# EAGLE design cartridge_e7 (EAGLE 7.7.0)
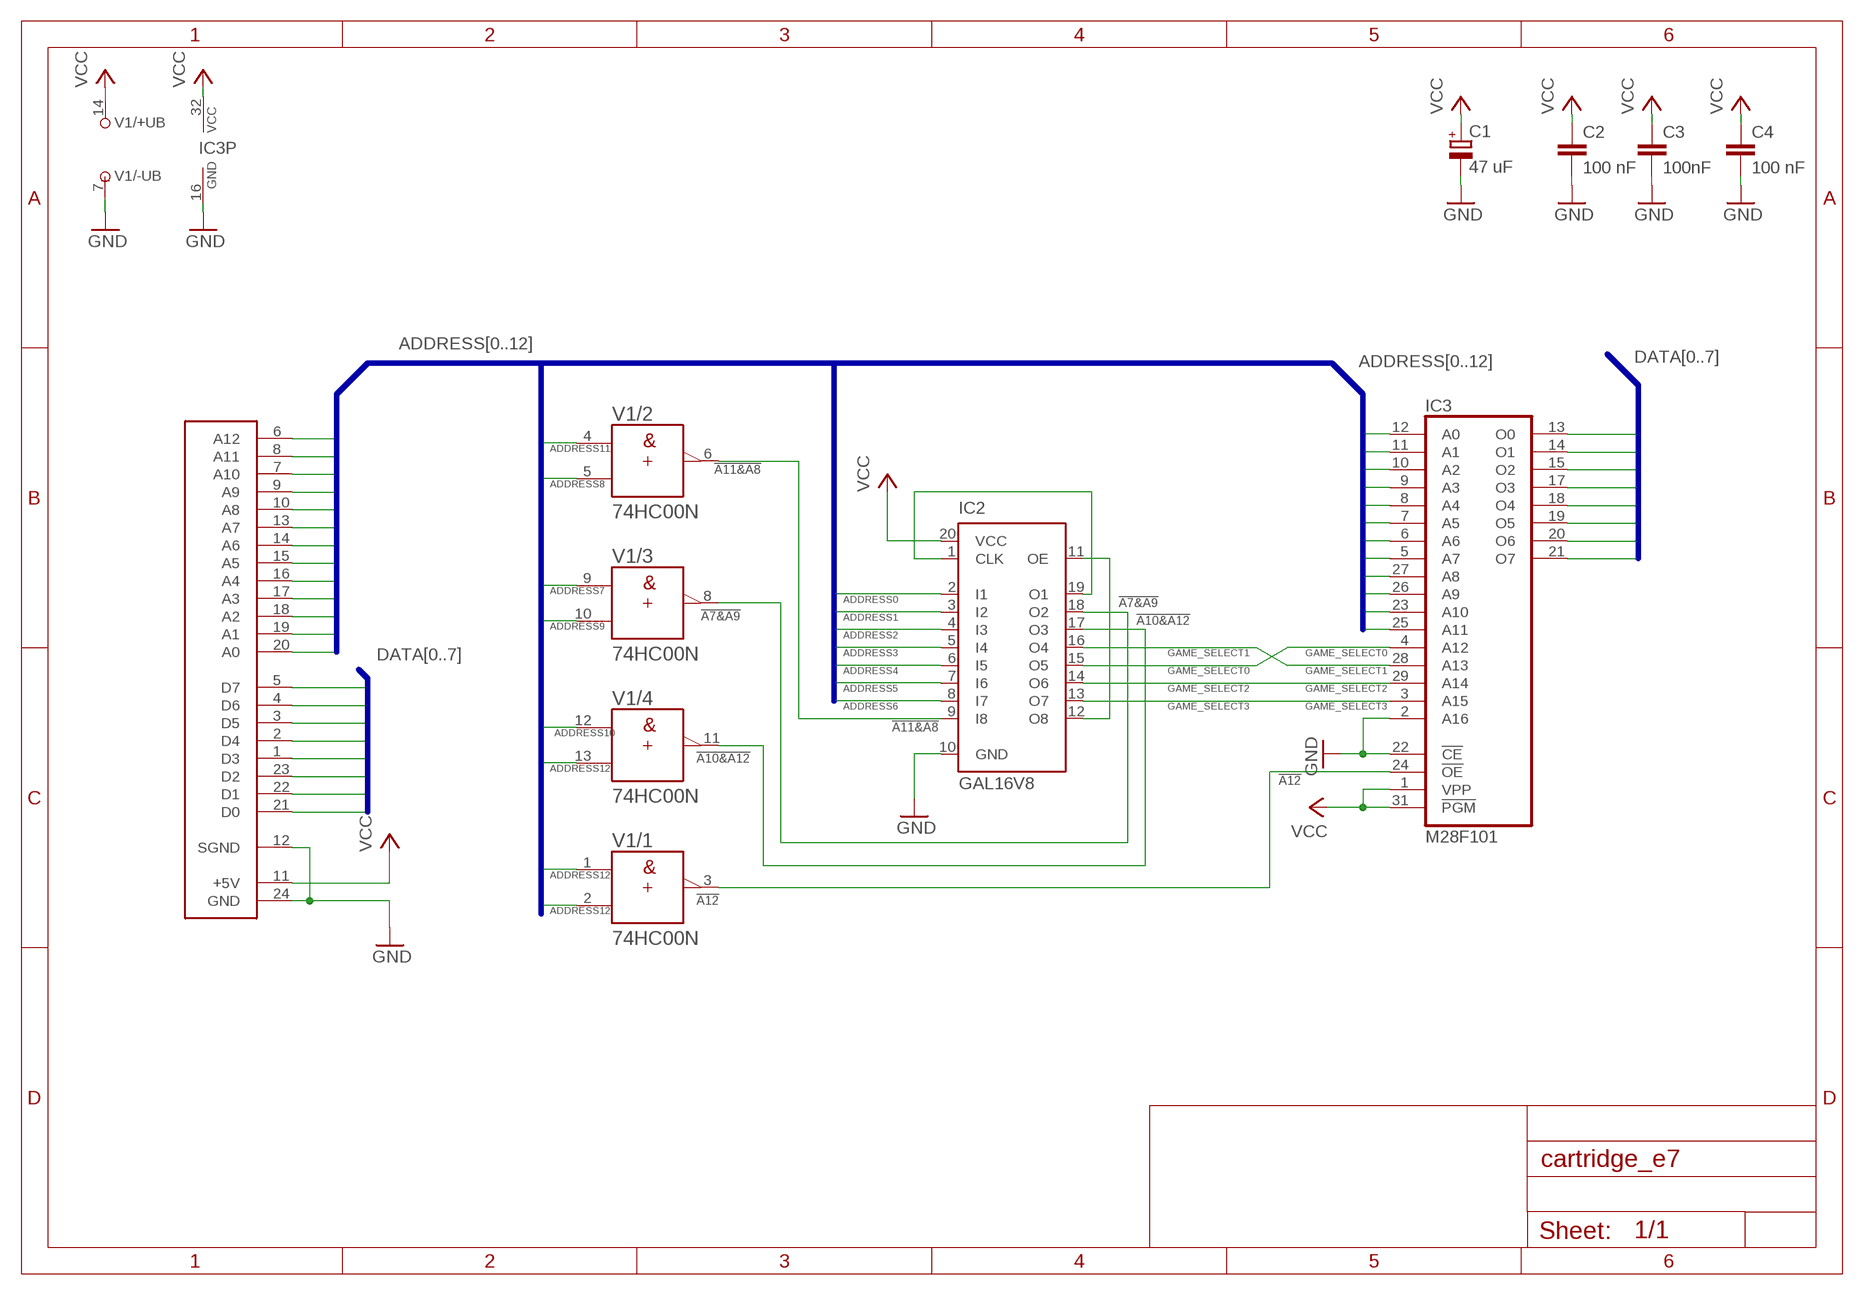
[diagram p0: schematic, sheet 1]

## Parts
C1  47 uF  CPOL-EUE3.5-8  [E3,5-8]
C2  100 nF  C-EU050-024X044  [C050-024X044]
C3  100nF  C-EU050-024X044  [C050-024X044]
C4  100 nF  C-EU050-024X044  [C050-024X044]
CONN1  24POSCELARGE  [2600LARGE]
IC2  GAL16V8  ATF16V8BP3  [DIL20]
IC3  M28F101  27010  [DIL32]
V1  74HC00N  [DIL14]

## Nets
!A7&A9: IC2.18(O2) V1.8(/3:Y)
!A10&A12: IC2.17(O3) V1.11(/4:Y)
!A11&A8: IC2.9(I8) V1.6(/2:Y)
!A12: IC3.24(!OE) V1.3(/1:Y)
ADDRESS0: CONN1.20(A0) IC2.2(I1) IC3.12(A0)
ADDRESS1: CONN1.19(A1) IC2.3(I2) IC3.11(A1)
ADDRESS2: CONN1.18(A2) IC2.4(I3) IC3.10(A2)
ADDRESS3: CONN1.17(A3) IC2.5(I4) IC3.9(A3)
ADDRESS4: CONN1.16(A4) IC2.6(I5) IC3.8(A4)
ADDRESS5: CONN1.15(A5) IC2.7(I6) IC3.7(A5)
ADDRESS6: CONN1.14(A6) IC2.8(I7) IC3.6(A6)
ADDRESS7: CONN1.13(A7) IC3.5(A7) V1.9(/3:A)
ADDRESS8: CONN1.10(A8) IC3.27(A8) V1.5(/2:B)
ADDRESS9: CONN1.9(A9) IC3.26(A9) V1.10(/3:B)
ADDRESS10: CONN1.7(A10) IC3.23(A10) V1.12(/4:A)
ADDRESS11: CONN1.8(A11) IC3.25(A11) V1.4(/2:A)
ADDRESS12: CONN1.6(A12) V1.1(/1:A) V1.2(/1:B) V1.13(/4:B)
DATA0: CONN1.21(D0) IC3.13(O0)
DATA1: CONN1.22(D1) IC3.14(O1)
DATA2: CONN1.23(D2) IC3.15(O2)
DATA3: CONN1.1(D3) IC3.17(O3)
DATA4: CONN1.2(D4) IC3.18(O4)
DATA5: CONN1.3(D5) IC3.19(O5)
DATA6: CONN1.4(D6) IC3.20(O6)
DATA7: CONN1.5(D7) IC3.21(O7)
GAME_SELECT0: IC2.15(O5) IC3.4(A12)
GAME_SELECT1: IC2.16(O4) IC3.28(A13)
GAME_SELECT2: IC2.14(O6) IC3.29(A14)
GAME_SELECT3: IC2.13(O7) IC3.3(A15)
GND: C1.- C2.2 C3.2 C4.2 CONN1.12(SGND) CONN1.24(GND) IC2.10(GND) IC3.2(A16) IC3.16(GND) IC3.22(!CE) V1.7(/-UB:-UB)
N$1: IC2.11(OE) IC2.12(O8)
N$2: IC2.1(CLK) IC2.19(O1)
VCC: C1.+ C2.1 C3.1 C4.1 CONN1.11(+5V) IC2.20(VCC) IC3.1(VPP) IC3.31(!PGM) IC3.32(VCC) V1.14(/+UB:+UB)

## Buses
DATA[0..7]
ADDRESS[0..12]

## Library data of the parts
C1 = resistor:CPOL-EU: POLARIZED CAPACITOR, European symbol
C2-C4 = resistor:C-EU: CAPACITOR, European symbol
CONN1 = 2600:24POSCE
IC2 = atmel:ATF16V8B: High perfomance CMOS (electrically erasable) programmable logic device (PLD) ABLE-Atmel-ABEL - P18V8R, P16V8C, P16V8AS, P17V8 COPL Atmel-WinCUPL - G16V8MS, G16V8MA, G16V8AS, G16V8 LOG/IC - GAL16V8_R, GAL16V8_G7, GAL16V8_C), GAL16V8 Tango-PLD - G16V8R, G16V8C, G16V8AS, G16V8 Source: http://www.atmel.com/dyn/resources/prod_documents/DOC0364.PDF; MPN: ATF16V8CZ-15PU; OC_FARNELL: 1551768; OC_NEWARK: 94M6254
IC3 = memory:27010: MEMORY; SPICEPREFIX: X
V1 = 74ttl-din:74*00: Quad 2-input NAND gate

## Board
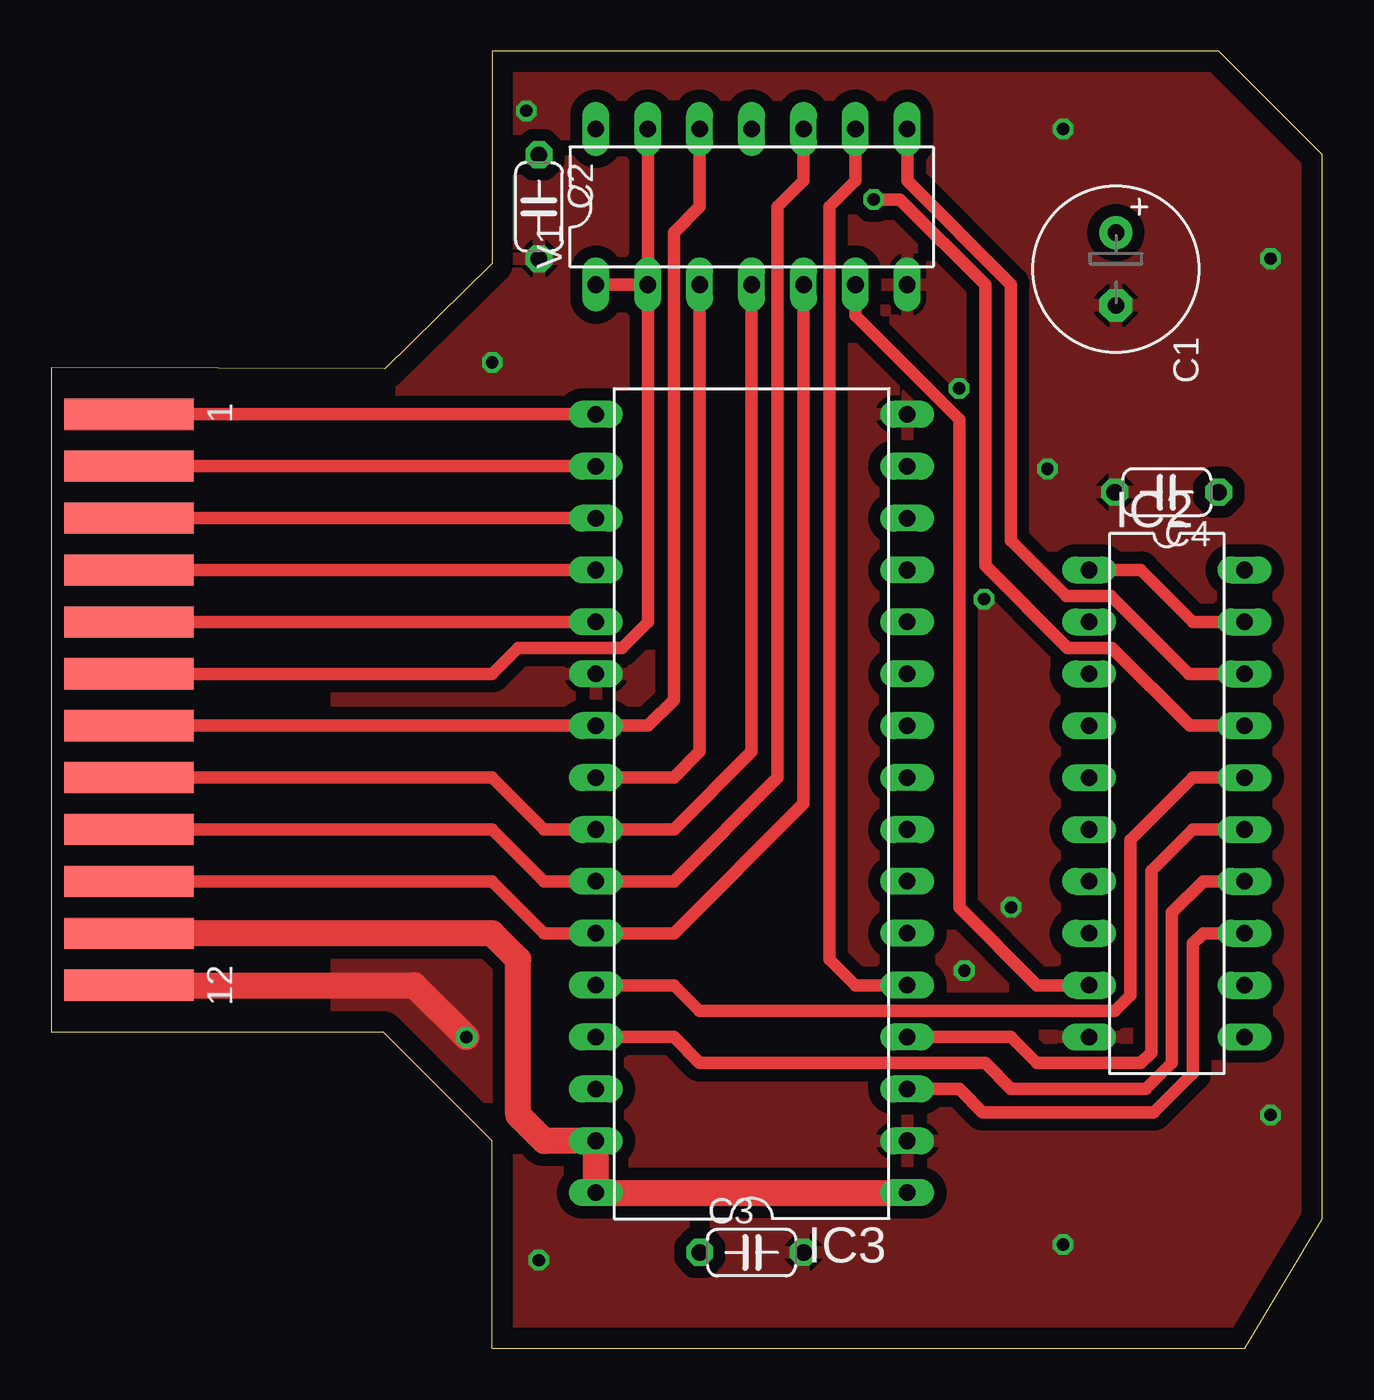
[diagram p1: board, top side]
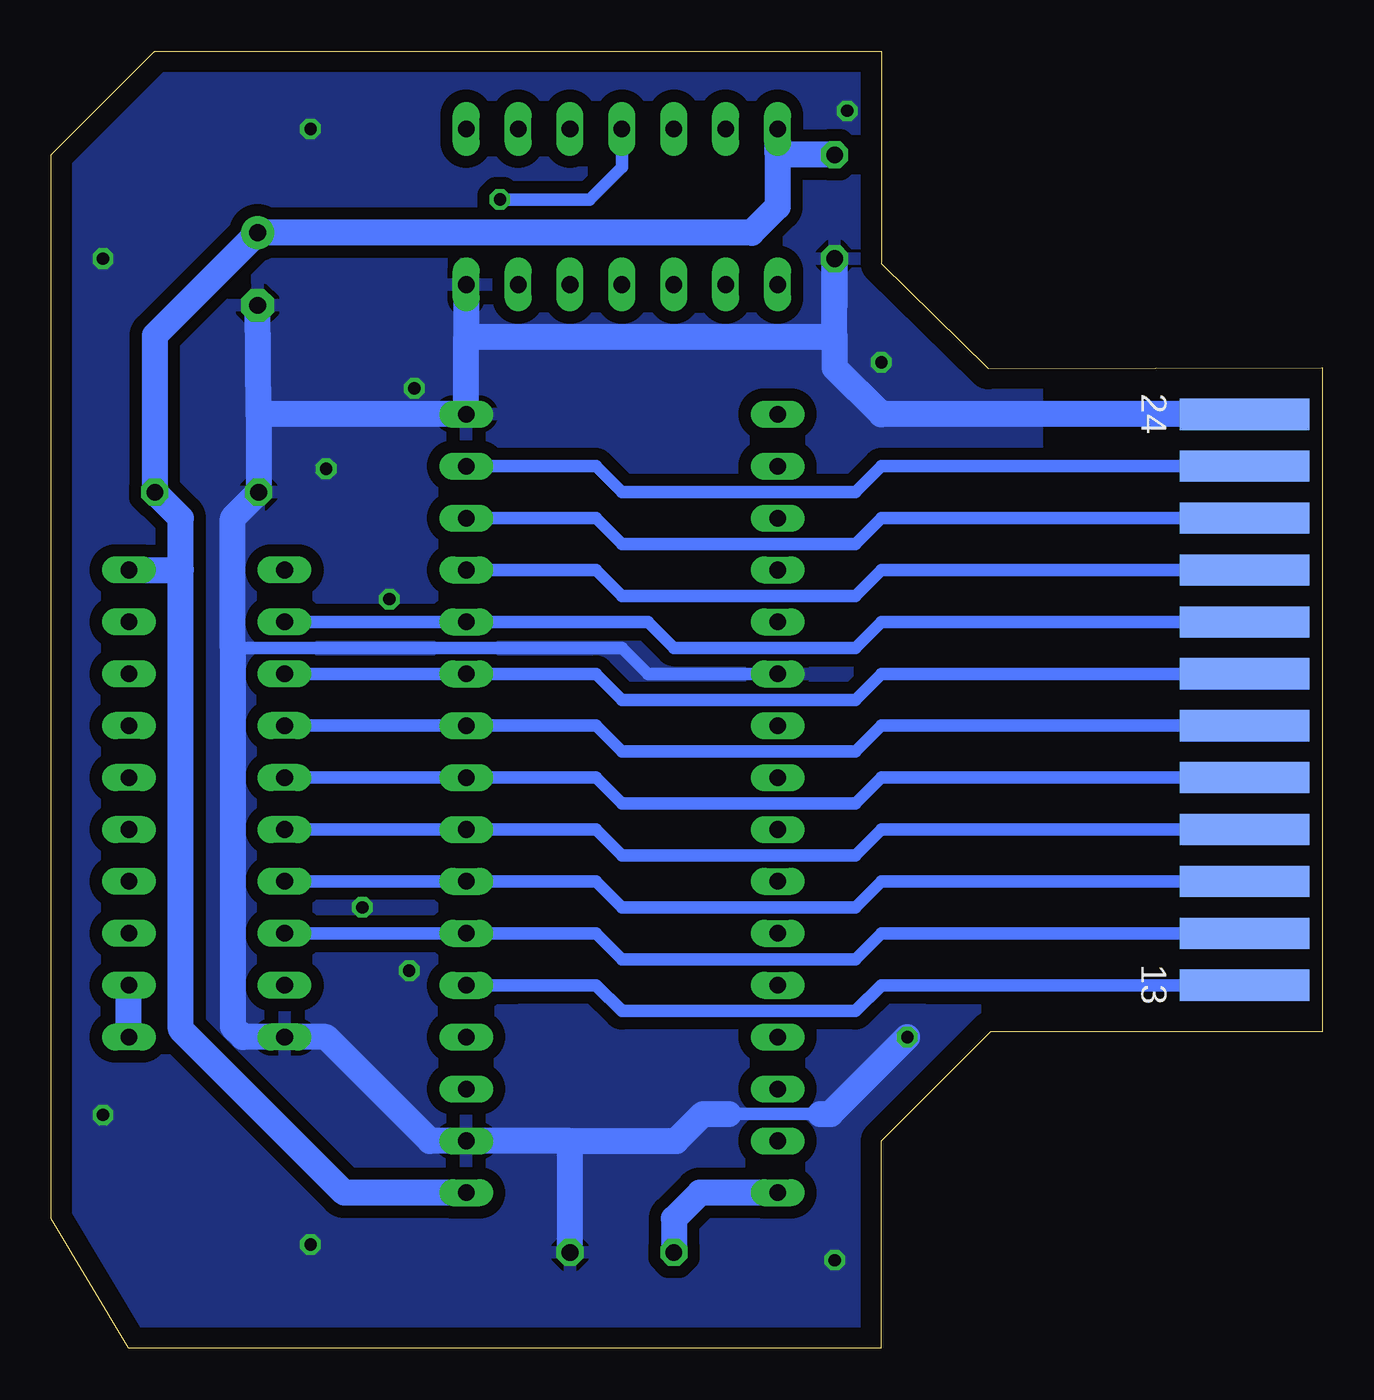
[diagram p2: board, bottom side, seen from below]

Size 62.23 x 63.5 mm. Coordinates in mm from the lower left corner, seen from the top.
Outline: 0,15.49 16.26,15.49 21.59,10.16 21.59,0 58.42,0 62.23,6.35 62.23,58.42 57.15,63.5 21.59,63.5 21.59,53.09 16.36,47.96 0,48.01 0,15.49
Copper layers (1*16): Top 0.035mm / dielectric 1.5mm / Bottom 0.035mm
Design rules "default": minimum track width 6mil, minimum drill 0.35mm, track to track 6mil, track to pad 6mil, pad to pad 6mil, via to via 6mil, smd to smd 6mil, copper to edge 40mil, drill to drill 6mil, minimum pad ring 10mil, minimum via ring 8mil, stop-mask expansion 4mil, vias tented up to drill 0mil, thermal gap 10mil

### Footprints (pad centres in the part's own frame; a part is rotated, then mirrored left to right if it is on the bottom)
E3,5-8 = drill 0.813 pad 1.6: + -1.778,0 | drill 0.813 pad 1.6 octagon: - 1.778,0
C050-024X044 = drill 0.813 octagon: 1 -2.54,0; 2 2.54,0
2600LARGE = smd 6.35 x 1.524: 1 3.81,13.97; 2 3.81,11.43; 3 3.81,8.89; 4 3.81,6.35; 5 3.81,3.81; 6 3.81,1.27; 7 3.81,-1.27; 8 3.81,-3.81; 9 3.81,-6.35; 10 3.81,-8.89; 11 3.81,-11.43; 12 3.81,-13.97 | smd 6.35 x 1.524 bottom: 13 3.81,-13.97; 14 3.81,-11.43; 15 3.81,-8.89; 16 3.81,-6.35; 17 3.81,-3.81; 18 3.81,-1.27; 19 3.81,1.27; 20 3.81,3.81; 21 3.81,6.35; 22 3.81,8.89; 23 3.81,11.43; 24 3.81,13.97
DIL20 = drill 0.813 long: 1 -11.43,-3.81; 2 -8.89,-3.81; 3 -6.35,-3.81; 4 -3.81,-3.81; 5 -1.27,-3.81; 6 1.27,-3.81; 7 3.81,-3.81; 8 6.35,-3.81; 9 8.89,-3.81; 10 11.43,-3.81; 11 11.43,3.81; 12 8.89,3.81; 13 6.35,3.81; 14 3.81,3.81; 15 1.27,3.81; 16 -1.27,3.81; 17 -3.81,3.81; 18 -6.35,3.81; 19 -8.89,3.81; 20 -11.43,3.81
DIL32 = drill 0.813 long: 1 -19.05,-7.62; 2 -16.51,-7.62; 3 -13.97,-7.62; 4 -11.43,-7.62; 5 -8.89,-7.62; 6 -6.35,-7.62; 7 -3.81,-7.62; 8 -1.27,-7.62; 9 1.27,-7.62; 10 3.81,-7.62; 11 6.35,-7.62; 12 8.89,-7.62; 13 11.43,-7.62; 14 13.97,-7.62; 15 16.51,-7.62; 16 19.05,-7.62; 17 19.05,7.62; 18 16.51,7.62; 19 13.97,7.62; 20 11.43,7.62; 21 8.89,7.62; 22 6.35,7.62; 23 3.81,7.62; 24 1.27,7.62; 25 -1.27,7.62; 26 -3.81,7.62; 27 -6.35,7.62; 28 -8.89,7.62; 29 -11.43,7.62; 30 -13.97,7.62; 31 -16.51,7.62; 32 -19.05,7.62
DIL14 = drill 0.813 long: 1 -7.62,-3.81; 2 -5.08,-3.81; 3 -2.54,-3.81; 4 0,-3.81; 5 2.54,-3.81; 6 5.08,-3.81; 7 7.62,-3.81; 8 7.62,3.81; 9 5.08,3.81; 10 2.54,3.81; 11 0,3.81; 12 -2.54,3.81; 13 -5.08,3.81; 14 -7.62,3.81

### Placement (x,y rotation side)
C1  52.12,52.83 270 top
C2  23.88,55.88 270 top
C3  34.29,4.7 0 top
C4  54.61,41.91 180 top
CONN1  0,31.75 0 top
IC2  54.61,26.67 270 top
IC3  34.29,26.67 90 top
V1  34.29,55.88 0 top

### Tracks (layer width: path | path; a pad name or v marks a point on that pad's centre or on a via)
!A7&A9
  Top 0.61: V1.8 41.91,57.15 46.99,52.07 46.99,39.54 49.7,36.83 51.87,36.83 55.68,33.02 IC2.18
!A10&A12  (via drill 0.6)
  Top 0.61: IC2.17 55.73,30.48 51.92,34.29 49.75,34.29 45.72,38.32 45.72,52.07 41.55,56.24 v40.26,56.24
  Bottom 0.61: V1.11 34.29,57.81 35.87,56.24 v40.26,56.24
!A11&A8
  Top 0.61: IC2.9 48.26,17.78 44.45,21.59 44.45,45.47 39.37,50.55 V1.6
!A12
  Top 0.61: IC3.24 30.48,27.94 31.75,29.21 V1.3
ADDRESS0
  Bottom 0.61: IC2.2 IC3.12 33.02,35.56 31.75,34.29 22.86,34.29 21.59,35.56 CONN1.20
ADDRESS1
  Bottom 0.61: IC2.3 IC3.11 35.56,33.02 34.29,31.75 22.86,31.75 21.59,33.02 CONN1.19
ADDRESS2
  Bottom 0.61: IC2.4 IC3.10 35.56,30.48 34.29,29.21 22.86,29.21 21.59,30.48 CONN1.18
ADDRESS3
  Bottom 0.61: CONN1.17 21.59,27.94 22.86,26.67 34.29,26.67 35.56,27.94 IC3.9 IC2.5
ADDRESS4
  Bottom 0.61: CONN1.16 21.59,25.4 22.86,24.13 34.29,24.13 35.56,25.4 IC3.8 IC2.6
ADDRESS5
  Bottom 0.61: IC2.7 IC3.7 35.56,22.86 34.29,21.59 22.86,21.59 21.59,22.86 CONN1.15
ADDRESS6
  Bottom 0.61: IC2.8 IC3.6 35.56,20.32 34.29,19.05 22.86,19.05 21.59,20.32 CONN1.14
ADDRESS7
  Top 0.61: V1.9 39.37,57.15 38.1,55.88 38.1,19.05 39.37,17.78 IC3.5
  Bottom 0.61: 39.37,17.78 IC3.5 35.56,17.78 34.29,16.51 22.86,16.51 21.59,17.78 19.05,17.78 | 19.42,17.78 19.05,17.78 | 19.05,17.78 CONN1.13
ADDRESS8
  Top 0.61: V1.5 36.83,26.67 30.48,20.32 IC3.27 24.13,20.32 21.59,22.86 CONN1.10
ADDRESS9
  Top 0.61: V1.10 36.83,57.15 35.56,55.88 35.56,27.94 30.48,22.86 IC3.26 24.13,22.86 21.59,25.4 CONN1.9
ADDRESS10
  Top 0.61: V1.12 31.75,55.88 30.48,54.61 30.48,31.75 29.21,30.48 IC3.23 CONN1.7
ADDRESS11
  Top 0.61: V1.4 34.29,29.21 30.48,25.4 IC3.25 24.13,25.4 21.59,27.94 CONN1.8
ADDRESS12
  Top 0.61: V1.1 V1.2 | V1.2 29.21,35.56 27.94,34.29 22.86,34.29 21.59,33.02 CONN1.6 | V1.2 V1.13
DATA0
  Bottom 0.61: IC3.13 35.56,38.1 34.29,36.83 22.86,36.83 21.59,38.1 CONN1.21
DATA1
  Bottom 0.61: IC3.14 35.56,40.64 34.29,39.37 22.86,39.37 21.59,40.64 CONN1.22
DATA2
  Bottom 0.61: IC3.15 35.56,43.18 34.29,41.91 22.86,41.91 21.59,43.18 CONN1.23
DATA3
  Top 0.61: CONN1.1 IC3.17
DATA4
  Top 0.61: CONN1.2 IC3.18
DATA5
  Top 0.61: CONN1.3 IC3.19
DATA6
  Top 0.61: CONN1.4 IC3.20
DATA7
  Top 0.61: IC3.21 CONN1.5
GAME_SELECT0
  Top 0.61: IC3.4 46.99,15.24 48.26,13.97 53.34,13.97 53.85,14.48 53.85,23.37 55.88,25.4 IC2.15
GAME_SELECT1
  Top 0.61: IC3.28 30.48,17.78 31.75,16.51 52.07,16.51 52.83,17.27 52.83,24.89 55.88,27.94 IC2.16
GAME_SELECT2
  Top 0.61: IC2.14 56.39,22.86 54.86,21.34 54.86,13.97 53.59,12.7 46.99,12.7 45.72,13.97 31.75,13.97 30.48,15.24 IC3.29
GAME_SELECT3
  Top 0.61: IC2.13 56.39,20.32 55.88,19.81 55.88,13.46 53.98,11.56 45.59,11.56 44.45,12.7 IC3.3
GND  (via drill 0.6)
  Top 1.27: v20.32,15.24 17.78,17.78 CONN1.12
  Bottom 0.61: IC3.2 38.1,10.16 | IC3.22 33.02,33.02 34.29,34.29 53.34,34.29 | 29.07,11.48 24.59,11.48
  Bottom 1.27: V1.7 41.91,49.53 | 41.91,49.53 IC3.16 52.07,45.72 | 23.88,51.05 C2.2 23.88,49.53 | 52.07,45.72 C4.2 53.34,40.64 53.34,34.29 53.34,15.75 52.83,15.24 IC2.10 48.77,15.24 43.69,10.16 IC3.2 36.83,10.16 | 52.07,45.72 C1.- | 36.83,10.16 31.63,10.16 30.31,11.48 29.07,11.48 | C3.2 36.83,10.16 | 24.59,11.48 24.08,11.48 v20.32,15.24 | CONN1.24 21.59,45.72 23.88,48.01 23.88,49.53 | 41.91,49.53 23.88,49.53
  other vias: 23.88,4.32 49.53,5.08 59.69,11.43 59.69,53.34 49.53,59.69 23.27,60.58 21.59,48.26 46.99,21.59 44.7,18.49 45.67,36.68 44.45,46.99 48.77,43.05
  pour Top (isolate 0.6): 13.97,48.26 16.51,48.26 20.32,52.07 20.32,63.5 57.15,63.5 63.5,57.15 63.5,6.35 58.42,0 20.32,0 20.32,10.16 15.24,15.24 13.97,15.24
  pour Bottom (isolate 0.6): 13.97,48.26 16.51,48.26 20.32,52.07 20.32,63.5 57.15,63.5 63.5,57.15 63.5,6.35 58.42,0 20.32,0 20.32,10.16 15.24,15.24 13.97,15.24
N$1
  Bottom 1.27: IC2.11 IC2.12
N$2
  Top 0.61: IC2.1 53.34,38.1 55.88,35.56 IC2.19
VCC
  Top 1.27: IC3.1 IC3.32 IC3.31 24.13,10.16 22.86,11.43 22.86,19.05 21.59,20.32 CONN1.11
  Bottom 1.27: 55.88,38.1 55.88,40.64 C4.1 57.15,49.58 C1.+ 27.94,54.61 26.67,55.88 26.67,58.42 | IC2.20 55.88,38.1 | IC3.1 47.88,7.62 55.88,15.62 55.88,38.1 | 26.67,58.42 V1.14 | IC3.32 30.48,7.62 31.75,6.35 C3.1 | C2.1 26.67,58.42